# Altium schematic sheet Sheet1.SchDoc
size A4; SheetNumber: 1; SheetTotal: 2
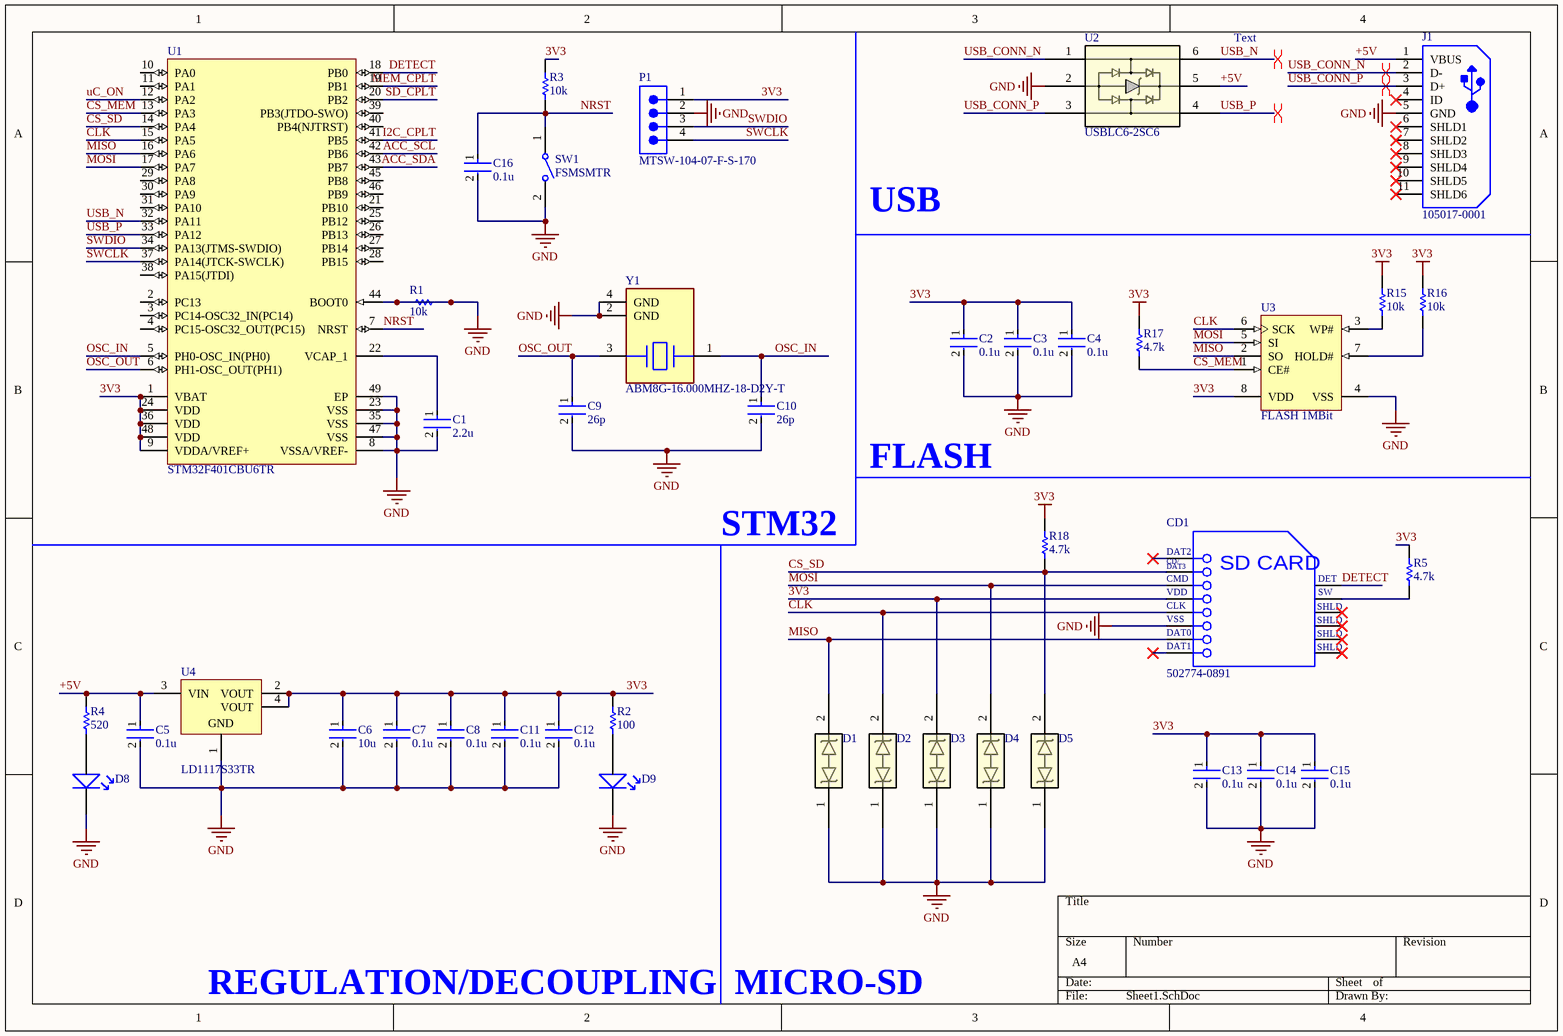
[diagram p0: Sheet1.SchDoc]

## Parts
C1  2.2u  [FP-C0603C-CF-MFG]
C2  0.1u  [FP-C0603C-CF-MFG]
C3  0.1u  [FP-C0603C-CF-MFG]
C4  0.1u  [FP-C0603C-CF-MFG]
C5  0.1u  [FP-C0603C-CF-MFG]
C6  10u  [FP-C0603C-CF-MFG]
C7  0.1u  [FP-C0603C-CF-MFG]
C8  0.1u  [FP-C0603C-CF-MFG]
C9  26p  [FP-C0603C-CF-MFG]
C10  26p  [FP-C0603C-CF-MFG]
C11  0.1u  [FP-C0603C-CF-MFG]
C12  0.1u  [FP-C0603C-CF-MFG]
C13  0.1u  [FP-C0603C-CF-MFG]
C14  0.1u  [FP-C0603C-CF-MFG]
C15  0.1u  [FP-C0603C-CF-MFG]
C16  0.1u  [FP-C0603C-CF-MFG]
CD1  502774-0891  [MOLX-502774-0891_V]
D1  DESD5V0U1BA-7  [SOD-323]  (value not drawn)
D2  DESD5V0U1BA-7  [SOD-323]  (value not drawn)
D3  DESD5V0U1BA-7  [SOD-323]  (value not drawn)
D4  DESD5V0U1BA-7  [SOD-323]  (value not drawn)
D5  DESD5V0U1BA-7  [SOD-323]  (value not drawn)
D8  0603 LED  [0603 LED]  (value not drawn)
D9  0603 LED  [0603 LED]  (value not drawn)
J1  105017-0001  [USB-MICRO-B_V]
P1  MTSW-104-07-F-S-170  [SMTC-MTSW-104-07-X-S-170]
R1  10k  [RESC1609X50X30NL8T20]
R2  100  [RESC1609X50X30NL8T20]
R3  10k  [RESC1609X50X30NL8T20]
R4  520  [RESC1609X50X30NL8T20]
R5  4.7k  [RESC1609X50X30NL8T20]
R15  10k  [RESC1609X50X30NL8T20]
R16  10k  [RESC1609X50X30NL8T20]
R17  4.7k  [RESC1609X50X30NL8T20]
R18  4.7k  [RESC1609X50X30NL8T20]
SW1  FSMSMTR  [TECO-FSMSMTR_V]
U1  STM32F401CBU6TR  [UQFN48 P0.5mm]
U2  USBLC6-2SC6  [SOT23-6L_STM]
U3  FLASH 1MBit  [SOIC8 3.9mm]
U4  LD1117S33TR  [SOT230P700X180-4N]
Y1  ABM8G-16.000MHZ-18-D2Y-T  [FP-ABM8G-MFG]

## Nets
3V3: C2.1 C3.1 C4.1 C6.1 C7.1 C8.1 C11.1 C12.1 C13.1 C14.1 C15.1 CD1.4(VDD) D3.2 P1.1 R2.2 R3.1 R5.2 R15.2 R16.2 R17.2 R18.2 U1.1(VBAT) U1.9(VDDA/VREF+) U1.24(VDD) U1.36(VDD) U1.48(VDD) U3.8(VDD) U4.2(VOUT) U4.4(VOUT)
GND: C1.2 C2.2 C3.2 C4.2 C5.2 C6.2 C7.2 C8.2 C9.2 C10.2 C11.2 C12.2 C13.2 C14.2 C15.2 C16.2 CD1.6(VSS) D1.1 D2.1 D3.1 D4.1 D5.1 D8.2 D9.2 J1.5(GND) P1.2 R1.1 R1.2 SW1.2 U1.8(VSSA/VREF-) U1.23(VSS) U1.35(VSS) U1.44(BOOT0) U1.47(VSS) U1.49(EP) U2.2 U3.4(VSS) U4.1(GND) Y1.2(GND) Y1.4(GND)
+5V: C5.1 J1.1(VBUS) R4.2 U2.5 U4.3(VIN)
ACC_SCL: U1.42(PB6)
ACC_SDA: U1.43(PB7)
CLK: CD1.5(CLK) D2.2 U1.15(PA5) U3.6(SCK)
CS_MEM: R17.1 U1.13(PA3) U3.1(CE#)
CS_SD: CD1.2(CD/DAT3) D5.2 R18.1 U1.14(PA4)
DETECT: CD1.9(DETECT) U1.18(PB0)
I2C_CPLT: U1.41(PB5)
MEM_CPLT: U1.19(PB1)
MISO: CD1.7(DAT0) D1.2 U1.16(PA6) U3.2(SO)
MOSI: CD1.3(CMD) D4.2 U1.17(PA7) U3.5(SI)
NRST: C16.1 R3.2 SW1.1 U1.7(NRST)
OSC_IN: C10.1 U1.5(PH0-OSC_IN(PH0)) Y1.1
OSC_OUT: C9.1 U1.6(PH1-OSC_OUT(PH1)) Y1.3
SD_CPLT: U1.20(PB2)
SWCLK: P1.4 U1.37(PA14(JTCK-SWCLK))
SWDIO: P1.3 U1.34(PA13(JTMS-SWDIO))
uC_ON: U1.12(PA2)
USB_CONN_N: J1.2(D-) U2.1
USB_CONN_P: J1.3(D+) U2.3
USB_N: U1.32(PA11) U2.6
USB_P: U1.33(PA12) U2.4
NetC1_1: C1.1 U1.22(VCAP_1)
NetCD1_10: CD1.10(SWITCH) R5.1
NetD8_1: D8.1 R4.1
NetD9_1: D9.1 R2.1
NetR15_1: R15.1 U3.3(WP#)
NetR16_1: R16.1 U3.7(HOLD#)

Not connected (* = marked no-connect by the designer): CD1 1(DAT2)* 8(DAT1)* 11(SHLD)* 12(SHLD)* 13(SHLD)* 14(SHLD)*; J1 4(ID)* 6(SHLD1)* 7(SHLD2)* 8(SHLD3)* 9(SHLD4)* 10(SHLD5)* 11(SHLD6)*; U1 2(PC13) 3(PC14-OSC32_IN(PC14)) 4(PC15-OSC32_OUT(PC15)) 10(PA0) 11(PA1) 21(PB10) 25(PB12) 26(PB13) 27(PB14) 28(PB15) 29(PA8) 30(PA9) 31(PA10) 38(PA15(JTDI)) 39(PB3(JTDO-SWO)) 40(PB4(NJTRST)) 45(PB8) 46(PB9)

## Layout directives
differential pair: USB_CONN_N, USB_CONN_P, USB_N, USB_P

## Notes on the sheet
- Text
- USB
- FLASH
- STM32
- REGULATION/DECOUPLING
- MICRO-SD
- (in symbol CMP-2000-05248-1) CD/; DAT3; SD CARD; DET; SW

## Library data of the parts
C1-C16 = CMP-2006-03061-2: CAP CER 0.1UF 50V X7R 0603; Manufacturer: KEMET; Manufacturer Part Number: C0603C104K5RACTU; Tolerance: 0.1; Temperature Coefficient: 30ppm/°C; Material: Ceramic; Automotive Grade: Grade 1; Value: 0.10 μF; Temperature: -55°C to +125°C; RoHS: TRUE; Temperature Range High: +125°C; Lead Free: Yes; Octopart: https://octopart.com/c0603c104k5ractu-kemet-139244; Digikey Description: CAP CER 0.1UF 50V X7R 0603; Category: Cap; Package: C0603C-CF; ComponentLink2Description: Datasheet; Temperature Range Low: -55°C; Device Class L1: Passive Components; Voltage Rating: 50 V; Automotive: Yes; Device Class L3: Ceramic Capacitors; ComponentLink2URL: https://api.kemet.com/component-edge/download/datasheet/C0603C100J5GACAUTO.pdf; Capacitance: 0.10 μF; Device Class L2: Capacitors; Temperature Characteristic: X7R; Height: 0.87mm
CD1 = CMP-2000-05248-1: Micro SD Memory Card Connector, 0.5 A, 10 V (DC), -25 to 85 degC, 8-Pin SMT, RoHS, Tape and Reel; Manufacturer: Molex; 3D Model: 502774-0891.stp; Online Catalog: microSD™Series; Number of Positions: 10(8+2); Card Type: SecureDigital-microSD™; Insertion, Removal Method: PushIn,PushOut; Other Names: WM24066DKR; Connector Type: ConnectorandEjector; Features: Switch; Family: MemoryConnectors-PCCardSockets; Manufacturer URL: http://www.molex.com/; Mounting Type: SurfaceMount,RightAngle; Contact Finish Thickness: 20µin(0.51µm); Standard Package: 1; Series: 502774; Ejector Side: -; Datasheet Version: Rev. D, 04/2004; Category: Connectors,Interconnects; Contact Finish: Gold; Datasheet URL: https://datasheet.ciiva.com/1104/1499551-1104671.pdf; RoHS Information: 502774-0891CertofCompliance; Mounting Feature: Reverse-Bottom; Packaging: Digi-Reel; Height Above Board: 0.071"(1.80mm); Catalog Drawings: 502774-0891
D1-D5 = DESD5V0U1BA-7: No Description Available; Mfr_Name: Diodes Inc; Type: DEV; Copyright: Copyright (C) 2023 Ultra Librarian. All rights reserved.; Manufacturer_Part_Number: DESD5V0U1BA-7; RefDes: RefDes
J1 = CMP-2000-05827-1: Micro-USB B Receptacle, Right Angle, Bottom Mount, Surface Mount, with Solder Tabs, -30 to 85 degC, 5-Pin USB, RoHS, Tape and Reel; Manufacturer: Molex; Featured Product: Micro-USBConnectorsUSBConnectors; Other Names: WM1399DKR; Package Version: Rev. F, 12/2012; Number of Contacts: 5; Connector Type: USB-microB; Catalog Drawings: 1050170001; 3D Model: 105017-0001.stp; Mating Products: WM17145-ND-CABLEMICROUSBBTOSTDA1.0MWM17147-ND-CABLEMICROUSBBTOSTDA2.0MWM17146-ND-CABLEMICROUSBBTOSTDA1.5M; PCN Assembly/Origin: ResinSupplier21/Oct/2015; Voltage - Max: 30V; Online Catalog: Molex-MicroUSB; Manufacturer URL: http://www.molex.com/; Package Description: 5-Leads USB, Micro B, Body 7.5 x 5 mm, Pitch 0.65 mm; Datasheet URL: http://www.molex.com/elqNow/elqRedir.htm?ref=http://www.molex.com/webdocs/datasheets/pdf/en-us/1050170001_IO_CONNECTORS.pdf; Ingress Protection: -; Datasheet Version: 03/2016; Mounting Type: BoardCutout,SurfaceMount,RightAngle; Circuits: 5; Standard Package: 1; Package Reference: MICRO-B; Package URL: http://www.molex.com/pdm_docs/sd/1050170001_sd.pdf; Category: Connectors,Interconnects; Series: -; RoHS Information: 1050170001CertofCompliance; Features: Shielded,SolderRetention; Family: USB,DVI,HDMIConnectors; Specifications: -; Gender: Receptacle; Packaging: Digi-Reel®; Mounting Technology: SurfaceMount
P1 = CMP-1024-00106-1: Modified .025" SQ Post Header, Through-hole, Vertical, -55 to 125 degC, 2.54 mm Pitch, 4-Pin, Male, RoHS; Manufacturer: Samtec; Pitch: 2.54 mm; Orientation: Vertical; ComponentLink1Description: Manufacturer URL; ComponentLink2Description: Datasheet; PackageReference: MTSW-104-07-X-S-170; PackageDescription: Assembly .025" [.64] SQ Post Terminal Strip; Temperature Range: -55 to 125 degC; PackageVersion: BI, 2/1987; PartNumber: MTSW-104-07-F-S-170; Mounting Technology: Through-hole; ComponentLink2URL: http://www.samtec.com/documents/webfiles/pdf/MTSW.PDF; ComponentLink3URL: http://www.samtec.com/documents/webfiles/cpdf/MTSW-XXX-XX-X-X-XXXX-XX-XXX-MKT1.pdf; DatasheetVersion: F-214; RoHS: True; ComponentLink3Description: Package Specification; ComponentLink1URL: http://www.samtec.com
R1-R5 R15-R18 = CMP-1666-00005-4: Chip Resistor, 10 KOhm, +/- 1%, 100 mW, -55 to 155 degC, 0603 (1608 Metric), RoHS, Tape and Reel; Manufacturer: Vishay Semiconductor; Voltage Rating: 75 V; Max Operating Temperature: 155 degC; PackageDescription: 2-Pin Surface Mount Device, Body 1.575 x 0.85 mm; ComponentLink1Description: Manufacturer URL; RoHSCompliant: true; PackageReference: 0603; REACH SVHC: Unknown; Length: 1.55 mm; DatasheetVersion: 06/2012; Packaging: Tape and Reel; Min Operating Temperature: -55 degC; Mounting Technology: Surface Mount; ComponentLink2URL: https://datasheet.ciiva.com/11809/0900766b80d98afc-11809037.pdf; Height: 0.45 mm; ComponentLink2Description: Datasheet; Package Quantity: 5000; ComponentLink1URL: http://www.vishay.com/
SW1 = CMP-2000-07501-1: FSMSM Push Button Switch, 50 mA, -35 to 85 degC, 2-Pin SMD, RoHS, Tape and Reel; Manufacturer: TE Connectivity; Voltage Rating (DC): 24V; Electrical Life: 20000Cycles; Operating Force: 180gf; Switch Travel: 0.25mm; Contact Current Rating: 50mA; Case\/Package: SMD/SMT; Actuator Length: 1.07mm; Throw Configuration: SPST; Actuator Material: Polyamide; Contact Resistance: 100mOhm; Illumination Type: Illuminated; Max Voltage Rating (DC): 12V; Manufacturer URL: http://www.te.com/; Lead Free: LeadFree; Packaging: TapeandReel; Min Operating Temperature: -35degC; Mechanical Life: 20000Cycles; Mount: SurfaceMount; REACH SVHC: Unknown; Package Quantity: 1800; Package Reference: FSMSMTR; RoHSCompliant: true; Max Operating Temperature: 85degC; Orientation: Straight; ELV: Compliant; Datasheet URL: http://www.te.com/commerce/DocumentDelivery/DDEController?Action=showdoc&DocId=Customer+Drawing%7F1437566-3%7FC2%7Fpdf%7FEnglish%7FENG_CD_1437566-3_C2_1437566_3_1_c.dwg.pdf%7F1437566-4; Package Description: 2-Pin Surface Mount Device, Body 6 x 3.5 mm, Pitch 9.19 mm; Current Rating: 50mA; Contact Plating: Silver; Termination: GullWing; Datasheet Version: Rev. C2, 08/2014; Contact Material: Brass; Mounting Technology: SurfaceMount
U1 = CMP-0243-00136-1: ARM Cortex-M4 32-bit MCU+FPU, 128 KB Flash, 64 KB Internal RAM, 36 I/Os, 48-Pin UFQFPN, -40 to 85 degC, Tape and Reel; Manufacturer: STMicroelectronics; Internal RAM Size (kB): 64; FLASH Size (Prog) (kB): 128; Operating Frequency(F) (Processor speed) (MHz): 84; I/Os (High Current): 36; Supply Voltage(Vcc) min (V): 1.7; Package Reference: 48-Pin Ultra Thin Fine Pitch Quad Flat No-Lead, 7 x 7 x 0.6 mm Body, 0.5 mm Pitch, Exposed Pad; Package Description: UFQFPN48; ComponentLink1Description: Manufacturer URL; ComponentLink2URL: http://www.st.com/st-web-ui/static/active/en/resource/technical/document/datasheet/DM00086815.pdf; ComponentLink2Description: Datasheet; ComponentLink1URL: http://www.st.com/; Mounting Technology: Surface Mount; Packing: Tape and Reel; Core: ARM Cortex-M4; DatasheetVersion: Rev. 5; Manufacturer Part Number: STM32F401CBU6TR
U2 = USBLC6-2SC6: No Description Available; Mfr_Name: STMicroelectronics; Copyright: Copyright (C) 2023 Ultra Librarian. All rights reserved.; Manufacturer_Part_Number: USBLC6-2SC6; RefDes: RefDes; Type: DEV
U3 = SST25VF010A-33-4I-SAE
U4 = LD1117S33TR: Fixed Positive LDO Regulator, 3.3V, 1.2V Dropout, BIPolar, PDSO4; Manufacturer: STMicroelectronics; Package Body Material: Plastic; Dropout Voltage1-Nom: 1.1V; Input Voltage Absolute-Max: 15V; Min Input Voltage: 4.75V; Line Regulation-Max: 0.006%; Load Regulation-Max: 0.01%; Channels: 1; Output Current1-Max: 1.3A; Output Voltage1-Max: 3.365V; Output Voltage1-Min: 3.235V; Regulator Type: FIXED POSITIVE SINGLE OUTPUT LDO REGULATOR; Time @ Peak Reflow Temperature-Max (s): 30s; Voltage Tolerance-Max: 2%; Qualification Status: Not Qualified; Supplier: Mouser; Supplier Part Number: 511-LD1117S33; Manufacturer Part Number: LD1117S33TR; RoHS: Yes; Category: Voltage Regulators - Linear; Stock: 175247; Pricing: 1=0.64, 10=0.53, 50=0.53, 100=0.386, 1000=0.291, 10000=0.229 (USD); Case/Package: SOP; Pins: 3; Package Shape: Rectangular; Terminal Finish: Tin; JESD-609 Code: e3; Adjustability: FIXED; Dropout Voltage1-Max: 1.2V; Max Supply Voltage: 15V; JESD-30 Code: R-PDSO-G3; Moisture Sensitivity Level: 1; Number of Outputs: 1; Operating Temperature, TJ-Max: 125°C; Operating Temperature, TJ-Min: 0°C; Output Voltage1-Nom: 3.3V; Package Style: SMALL OUTLINEMeter; Packaging: Tape and Reel; Peak Reflow Temperature (Cel): 260°C; Surface Mount: Yes; Technology: BIPOLAR; Terminal Form: Gull Wing; Terminal Position: DUAL; Length: 6.5mm; Width: 3.5mm; Height - Seated (Max): 1.9mm; Terminal Pitch: 2.3mm; RoHS Compliant: Yes; Reach SVHC Compliant: No; ComponentLink1URL: https://datasheet.ciiva.com:443/pdfs/VipMasterIC/IC/SGST/SGST-S-A0009691890/SGST-S-A0009691890-1.pdf?src-supplier=IHS+Markit; ComponentLink1Description: https://datasheet.ciiva.com:443/pdfs/VipMasterIC/IC/SGST/SGST-S-A0009691890/SGST-S-A0009691890-1.pdf?src-supplier=IHS+Markit; ComponentLink2URL: https://datasheet.ciiva.com/19478/1390240-19478097.pdf?src-supplier=Jameco; ComponentLink2Description: https://datasheet.ciiva.com/19478/1390240-19478097.pdf?src-supplier=Jameco; ComponentLink3URL: https://datasheet.ciiva.com/1511/1776449-1511573.pdf?src-supplier=Element14; ComponentLink3Description: https://datasheet.ciiva.com/1511/1776449-1511573.pdf?src-supplier=Element14; ComponentLink4URL: https://datasheet.ciiva.com/7992/1776449-7992621.pdf?src-supplier=Element14; ComponentLink4Description: https://datasheet.ciiva.com/7992/1776449-7992621.pdf?src-supplier=Element14; ComponentLink5URL: https://datasheet.ciiva.com/28652/1776449-28652462.pdf?src-supplier=Element14; ComponentLink5Description: https://datasheet.ciiva.com/28652/1776449-28652462.pdf?src-supplier=Element14; ComponentLink6URL: https://datasheet.ciiva.com/2041/cd00000544-2041942.pdf?src-supplier=Digi-Key; ComponentLink6Description: https://datasheet.ciiva.com/2041/cd00000544-2041942.pdf?src-supplier=Digi-Key; ComponentLink7URL: https://datasheet.ciiva.com/2041/cd00000544-2041941.pdf?src-supplier=Digi-Key; ComponentLink7Description: https://datasheet.ciiva.com/2041/cd00000544-2041941.pdf?src-supplier=Digi-Key; ComponentLink8URL: https://datasheet.ciiva.com/2041/cd00000544-2041943.pdf?src-supplier=Digi-Key; ComponentLink8Description: https://datasheet.ciiva.com/2041/cd00000544-2041943.pdf?src-supplier=Digi-Key; ComponentLink9URL: https://datasheet.ciiva.com/16396/cd00000544-16396459.pdf?src-supplier=Future+Electronics; ComponentLink9Description: https://datasheet.ciiva.com/16396/cd00000544-16396459.pdf?src-supplier=Future+Electronics
Y1 = CMP-27762-006537-2: Crystal 16MHz ±20ppm (Tol) ±30ppm (Stability) 18pF FUND 80Ω 4-Pin SMD T/R; Series Resistance: 80R; Radiation Hardening: No; Load Capacitance: 18pF; Package Quantity: 1000; Frequency Stability: 30ppm; ESR (Equivalent Series Resistance): 80R; Depth: 2.5mm; Height: 1mm; Number of Pins: 4; Frequency Tolerance: 20ppm; Frequency: 16MHz; Tolerance: 20ppm; Min Operating Temperature: -40°C; Length: 3.2mm; Termination: SMD/SMT; Max Operating Temperature: 85°C; Width: 2.5mm; Series: ABM8G; Mount: Surface Mount; Case/Package: CSMD; Lead Free: Lead Free; Operating Frequency: 16 MHz; Packaging: Tape and Reel